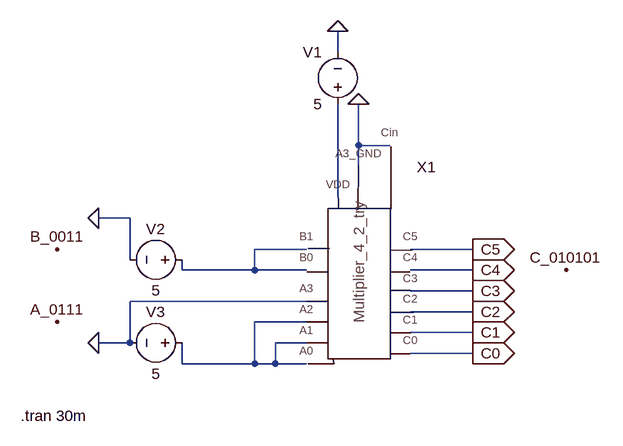
[diagram p0: schematic Simulating_Multiplier_4_2_try_works.asc]
Simulating_Multiplier_4_2_try_works.asc, the LTspice schematic file:
Version 4
SHEET 1 880 680
WIRE 256 -128 256 -160
WIRE 288 16 288 -48
WIRE 336 16 288 16
WIRE 288 48 288 16
WIRE 256 96 256 -48
WIRE -64 128 -112 128
WIRE 208 176 128 176
WIRE 464 176 368 176
WIRE -64 192 -64 128
WIRE 16 208 16 192
WIRE 128 208 128 176
WIRE 128 208 16 208
WIRE 208 208 128 208
WIRE 464 208 368 208
WIRE 464 240 368 240
WIRE 208 256 -64 256
WIRE 464 272 368 272
WIRE 208 288 128 288
WIRE 464 304 368 304
WIRE -64 320 -64 256
WIRE -64 320 -112 320
WIRE 208 320 160 320
WIRE 464 336 368 336
WIRE 16 352 16 320
WIRE 128 352 128 288
WIRE 128 352 16 352
WIRE 160 352 160 320
WIRE 160 352 128 352
WIRE 208 352 160 352
FLAG -112 128 0
FLAG -176 176 B_0011
FLAG -176 288 A_0111
FLAG 464 176 C5
IOPIN 464 176 Out
FLAG 464 208 C4
IOPIN 464 208 Out
FLAG 464 240 C3
IOPIN 464 240 Out
FLAG 464 272 C2
IOPIN 464 272 Out
FLAG 464 304 C1
IOPIN 464 304 Out
FLAG 464 336 C0
IOPIN 464 336 Out
FLAG 256 -160 0
FLAG -112 320 0
FLAG 288 -48 0
FLAG 608 208 C_010101
SYMBOL voltage 256 -32 R180
WINDOW 0 24 96 Left 2
WINDOW 3 24 16 Left 2
WINDOW 123 0 0 Left 2
WINDOW 39 0 0 Left 2
SYMATTR InstName V1
SYMATTR Value 5
SYMBOL voltage 32 192 R90
WINDOW 0 -32 56 VBottom 2
WINDOW 3 32 56 VTop 2
WINDOW 123 0 0 Left 2
WINDOW 39 0 0 Left 2
SYMATTR InstName V2
SYMATTR Value 5
SYMBOL voltage 32 320 R90
WINDOW 0 -32 56 VBottom 2
WINDOW 3 32 56 VTop 2
WINDOW 123 0 0 Left 2
WINDOW 39 0 0 Left 2
SYMATTR InstName V3
SYMATTR Value 5
SYMBOL Mult_4_2_try 320 208 R0
SYMATTR InstName X1
TEXT -232 432 Left 2 !.tran 30m

The netlist it stands for:
* Simulating_Multiplier_4_2_try_works.asc
V1 N001 0 5
V2 N002 0 5
V3 N003 0 5
XX1 N003 N003 N003 0 N002 N002 N001 0 0 C5 C4 C3 C2 C1 C0 Mult_4_2_try  ; pins A0 A1 A2 A3 B0 B1 VDD A3_GND Cin C5 C4 C3 C2 C1 C0
.tran 30m
.backanno
.end